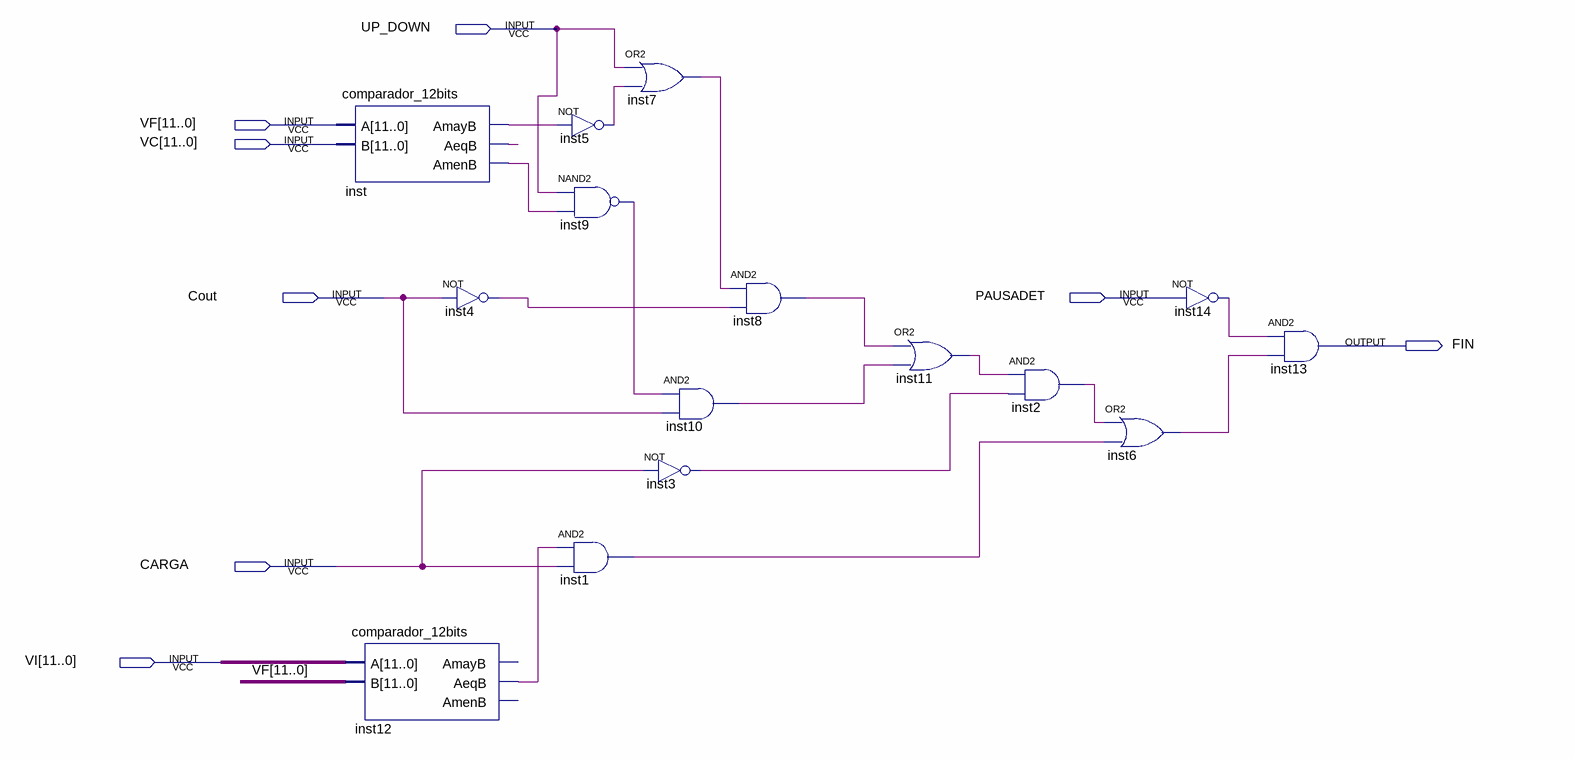
[diagram p0: schematic sheet]
// Quartus schematic UC_detector_fin.bdf as structural Verilog: 15 symbols, 8 pins
module UC_detector_fin (
  input  UP_DOWN,
  input  [11:0] VF,
  input  [11:0] VC,
  input  Cout,
  input  PAUSADET,
  input  CARGA,
  input  [11:0] VI,
  output FIN
);

  wire inst1_out, inst2_out, inst3_out, inst4_out, inst5_out, inst6_out, inst7_out, inst8_out, inst9_out,
       inst10_out, inst11_out, inst12_aeqb, inst14_out, inst_aeqb, inst_amayb, inst_amenb;

  comparador_12bits inst (.A(VF), .B(VC), .AmayB(inst_amayb), .AeqB(inst_aeqb), .AmenB(inst_amenb));
  comparador_12bits inst12 (.A(VI), .B(VF), .AeqB(inst12_aeqb));  // open: AmayB, AmenB
  not inst4 (inst4_out, Cout);
  not inst5 (inst5_out, inst_amayb);
  nand inst9 (inst9_out, UP_DOWN, inst_amenb);
  and inst1 (inst1_out, inst12_aeqb, CARGA);
  or inst7 (inst7_out, UP_DOWN, inst5_out);
  and inst10 (inst10_out, inst9_out, Cout);
  not inst3 (inst3_out, CARGA);
  and inst8 (inst8_out, inst7_out, inst4_out);
  or inst11 (inst11_out, inst8_out, inst10_out);
  and inst2 (inst2_out, inst11_out, inst3_out);
  or inst6 (inst6_out, inst2_out, inst1_out);
  not inst14 (inst14_out, PAUSADET);
  and inst13 (FIN, inst14_out, inst6_out);
endmodule
